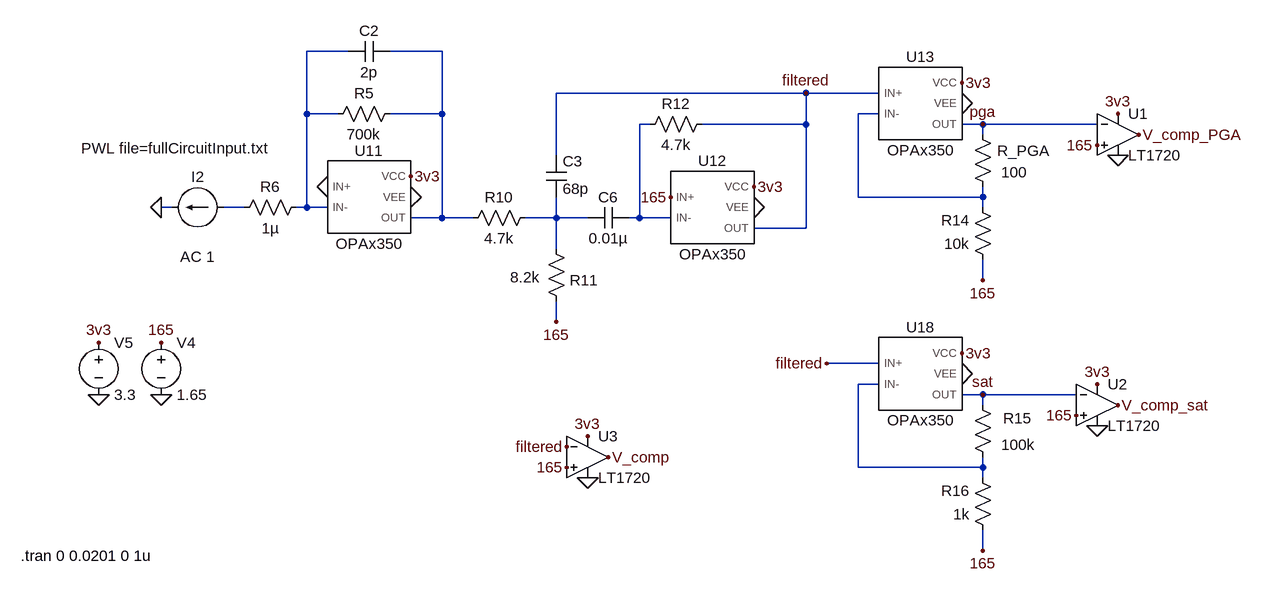
[diagram p0: schematic circuitRR.asc]
circuitRR.asc, the LTspice schematic file:
Version 4.1
SHEET 1 1996 1676
WIRE 0 800 -64 800
WIRE 144 800 64 800
WIRE 704 864 320 864
WIRE 816 864 704 864
WIRE -64 896 -64 800
WIRE -16 896 -64 896
WIRE 144 896 144 800
WIRE 144 896 64 896
WIRE 816 896 784 896
WIRE 464 912 448 912
WIRE 704 912 704 864
WIRE 704 912 544 912
WIRE 976 912 944 912
WIRE 1152 912 976 912
WIRE 976 928 976 912
WIRE 320 960 320 864
WIRE 784 1024 784 896
WIRE 976 1024 976 1008
WIRE 976 1024 784 1024
WIRE -272 1040 -288 1040
WIRE -160 1040 -192 1040
WIRE -64 1040 -64 896
WIRE -64 1040 -80 1040
WIRE -32 1040 -64 1040
WIRE 976 1040 976 1024
WIRE 144 1056 144 896
WIRE 144 1056 96 1056
WIRE 192 1056 144 1056
WIRE 320 1056 320 1024
WIRE 320 1056 272 1056
WIRE 368 1056 320 1056
WIRE 448 1056 448 912
WIRE 448 1056 432 1056
WIRE 496 1056 448 1056
WIRE 704 1072 704 912
WIRE 704 1072 624 1072
WIRE 320 1104 320 1056
WIRE 976 1152 976 1120
WIRE 320 1216 320 1184
WIRE 816 1280 736 1280
WIRE 816 1312 784 1312
WIRE 976 1328 944 1328
WIRE 1120 1328 976 1328
WIRE 976 1344 976 1328
WIRE 784 1440 784 1312
WIRE 976 1440 976 1424
WIRE 976 1440 784 1440
WIRE 976 1456 976 1440
WIRE 976 1568 976 1536
FLAG 96 992 3v3
FLAG 96 1024 0
FLAG -288 1040 0
FLAG 624 1008 3v3
FLAG 624 1040 0
FLAG 704 864 filtered
FLAG -288 1328 0
FLAG -384 1328 0
FLAG -384 1248 3v3
FLAG -288 1248 165
FLAG 320 1216 165
FLAG 496 1024 165
FLAG 944 1264 3v3
FLAG 944 1296 0
FLAG 976 1568 165
FLAG 944 848 3v3
FLAG 944 880 0
FLAG 976 1152 165
FLAG 1152 944 165
FLAG 1184 896 3v3
FLAG 1184 960 0
FLAG 336 1408 filtered
FLAG 1216 928 V_comp_PGA
FLAG 1184 1344 V_comp_sat
FLAG 400 1424 V_comp
FLAG -32 1008 0
FLAG 1120 1360 165
FLAG 1152 1312 3v3
FLAG 1152 1376 0
FLAG 336 1440 165
FLAG 368 1392 3v3
FLAG 368 1456 0
FLAG 736 1280 filtered
FLAG 976 912 pga
FLAG 976 1328 sat
SYMBOL res 80 880 R90
WINDOW 0 0 56 VBottom 2
WINDOW 3 32 56 VTop 2
SYMATTR InstName R5
SYMATTR Value 700k
SYMBOL cap 64 784 R90
WINDOW 0 0 32 VBottom 2
WINDOW 3 32 32 VTop 2
SYMATTR InstName C2
SYMATTR Value 2p
SYMBOL res -64 1024 R90
WINDOW 0 0 56 VBottom 2
WINDOW 3 32 56 VTop 2
SYMATTR InstName R6
SYMATTR Value 1µ
SYMBOL current -192 1040 R90
WINDOW 0 -32 40 VBottom 2
WINDOW 3 -107 75 VTop 2
WINDOW 123 60 40 VTop 2
WINDOW 39 0 0 Left 0
SYMATTR InstName I2
SYMATTR Value PWL file=fullCircuitInput.txt
SYMATTR Value2 AC 1
SYMBOL LTSpiceModels\\sbom071e\\OPAx350 32 1024 R0
SYMATTR InstName U11
SYMBOL res 288 1040 R90
WINDOW 0 0 56 VBottom 2
WINDOW 3 32 56 VTop 2
SYMATTR InstName R10
SYMATTR Value 4.7k
SYMBOL res 336 1200 R180
WINDOW 0 -49 48 Left 2
WINDOW 3 41 53 Left 2
SYMATTR InstName R11
SYMATTR Value 8.2k
SYMBOL cap 304 960 R0
WINDOW 0 26 9 Left 2
WINDOW 3 26 51 Left 2
SYMATTR InstName C3
SYMATTR Value 68p
SYMBOL cap 432 1040 R90
WINDOW 0 0 32 VBottom 2
WINDOW 3 32 32 VTop 2
SYMATTR InstName C6
SYMATTR Value 0.01µ
SYMBOL res 560 896 R90
WINDOW 0 0 56 VBottom 2
WINDOW 3 32 56 VTop 2
SYMATTR InstName R12
SYMATTR Value 4.7k
SYMBOL LTSpiceModels\\sbom071e\\OPAx350 560 1040 R0
SYMATTR InstName U12
SYMBOL voltage -288 1232 R0
WINDOW 123 0 0 Left 0
WINDOW 39 0 0 Left 0
SYMATTR InstName V4
SYMATTR Value 1.65
SYMBOL voltage -384 1232 R0
WINDOW 123 0 0 Left 0
WINDOW 39 0 0 Left 0
SYMATTR InstName V5
SYMATTR Value 3.3
SYMBOL LTSpiceModels\\sbom071e\\OPAx350 880 1296 R0
SYMATTR InstName U18
SYMBOL res 992 1440 R180
WINDOW 0 -60 76 Left 2
WINDOW 3 -65 35 Left 2
SYMATTR InstName R15
SYMATTR Value 100k
SYMBOL res 992 1552 R180
WINDOW 0 36 76 Left 2
WINDOW 3 36 40 Left 2
SYMATTR InstName R16
SYMATTR Value 1k
SYMBOL LTSpiceModels\\sbom071e\\OPAx350 880 880 R0
SYMATTR InstName U13
SYMBOL res 992 1024 R180
WINDOW 0 -87 71 Left 2
WINDOW 3 -53 38 Left 2
SYMATTR InstName R_PGA
SYMATTR Value 100
SYMBOL res 992 1136 R180
WINDOW 0 36 76 Left 2
WINDOW 3 36 40 Left 2
SYMATTR InstName R14
SYMATTR Value 10k
SYMBOL Comparators\\LT1720 1184 864 R0
SYMATTR InstName U1
SYMBOL Comparators\\LT1720 1152 1280 R0
SYMATTR InstName U2
SYMBOL Comparators\\LT1720 368 1360 R0
SYMATTR InstName U3
TEXT -504 1576 Left 2 !.tran 0 0.0201 0 1u

The netlist it stands for:
* circuitRR.asc
R5 N002 N001 700k
C2 N002 N001 2p
R6 N001 N005 1µ
I2 N005 0 PWL file=fullCircuitInput.txt AC 1
X§U11 0 N001 3v3 0 N002 OPAx350  ; pins IN+ IN- VCC VEE OUT
R10 N006 N002 4.7k
R11 165 N006 8.2k
C3 filtered N006 68p
C6 N004 N006 0.01µ
R12 filtered N004 4.7k
X§U12 165 N004 3v3 0 filtered OPAx350  ; pins IN+ IN- VCC VEE OUT
V4 165 0 1.65
V5 3v3 0 3.3
X§U18 filtered N007 3v3 0 sat OPAx350  ; pins IN+ IN- VCC VEE OUT
R15 N007 sat 100k
R16 165 N007 1k
X§U13 filtered N003 3v3 0 pga OPAx350  ; pins IN+ IN- VCC VEE OUT
R_PGA N003 pga 100
R14 165 N003 10k
X§U1 165 pga 3v3 0 V_comp_PGA LT1720  ; pins In+ In- V+ V- OUT
X§U2 165 sat 3v3 0 V_comp_sat LT1720  ; pins In+ In- V+ V- OUT
X§U3 165 filtered 3v3 0 V_comp LT1720  ; pins In+ In- V+ V- OUT
.tran 0 0.0201 0 1u
.lib C:\Users\jpulu\OneDrive\Área de Trabalho\TCC\LTSpiceModels\sbom071e\OPAx350.LIB
.lib LT1720.sub
.backanno
.end